# Altium schematic sheet Motherboard_Top_trimmed.SchDoc: Interact Lab Motherboard
size A4; DrawnBy: Ben Kazemi; Engineer: Ben Kazemi; DocumentNumber: 1; Revision: 1; SheetNumber: 1; SheetTotal: 3; Number: Top; DocumentName: Interact Lab Motherboard; ProjectName: Interact Lab Motherboard
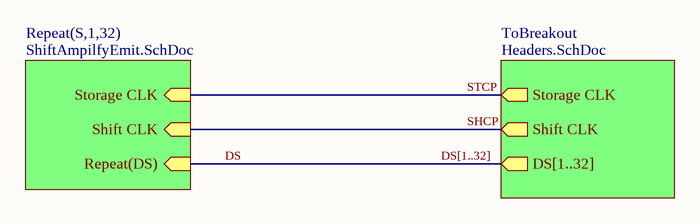
[diagram p0: Motherboard_Top_trimmed.SchDoc]

## Sub-sheets
Repeat(S,1,32) = ShiftAmpilfyEmit.SchDoc: Storage CLK (in), Shift CLK (in), Repeat(DS) (in)
ToBreakout = Headers.SchDoc: Storage CLK (out), Shift CLK (out), DS[1..32] (out)

## Nets
DS: sheet Repeat(S,1,32)/Repeat(DS)
SHCP: sheet Repeat(S,1,32)/Shift CLK, sheet ToBreakout/Shift CLK
STCP: sheet Repeat(S,1,32)/Storage CLK, sheet ToBreakout/Storage CLK

## Buses and harness runs
bus DS[1..32] = sheet ToBreakout/DS[1..32]